# Altium schematic sheet Fleet-Monitor-Ethernet.SchDoc: Fleet Monitor
size A4; Subtitle: Ethernet Interface; DocumentNumber: 5; Revision: V1.0; SheetNumber: 6; SheetTotal: 8; Author: Florian Baumgartner & Luca Jost
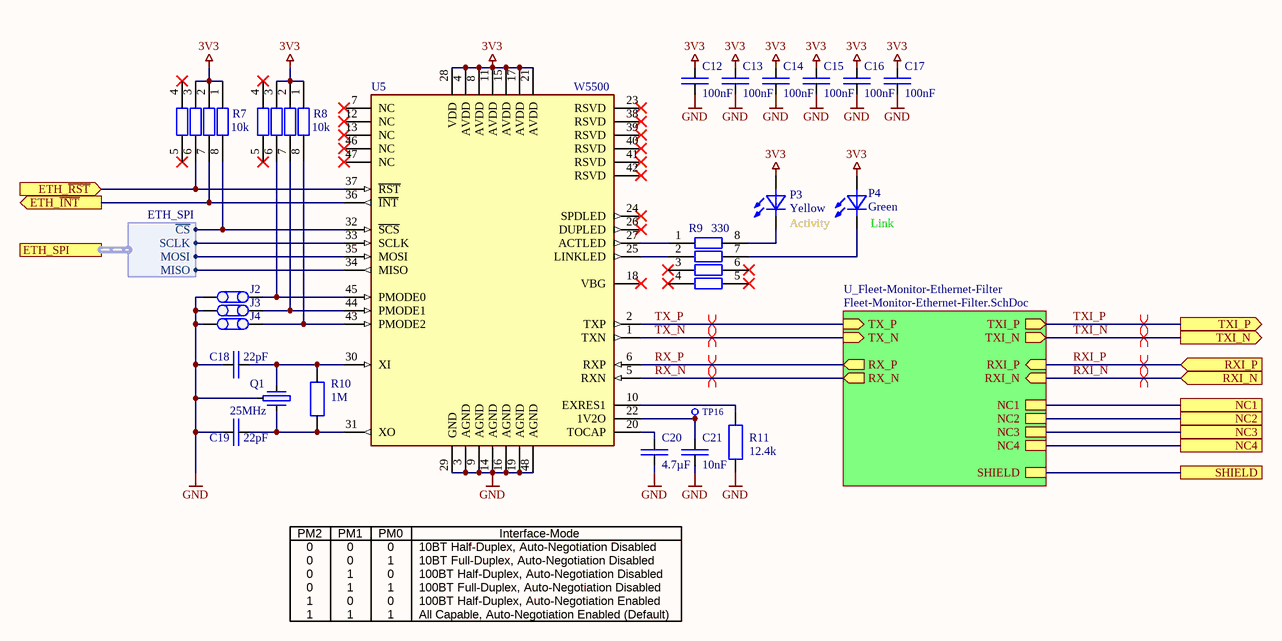
[diagram p0: Fleet-Monitor-Ethernet.SchDoc]

## Parts
C12  100nF  [SMD Keramikkondensator 0603]
C13  100nF  [SMD Keramikkondensator 0603]
C14  100nF  [SMD Keramikkondensator 0603]
C15  100nF  [SMD Keramikkondensator 0603]
C16  100nF  [SMD Keramikkondensator 0603]
C17  100nF  [SMD Keramikkondensator 0603]
C18  22pF  [SMD Keramikkondensator 0603]
C19  22pF  [SMD Keramikkondensator 0603]
C20  4.7µF  [SMD Keramikkondensator 0603]
C21  10nF  [SMD Keramikkondensator 0603]
J2  X-Jumper (2 Fach)  [SMD Solder Jumper 1x2mm]  (value not drawn)
J3  X-Jumper (2 Fach)  [SMD Solder Jumper 1x2mm]  (value not drawn)
J4  X-Jumper (2 Fach)  [SMD Solder Jumper 1x2mm]  (value not drawn)
P3  Yellow  [SMD LED 0603]
P4  Green  [SMD LED 0603]
Q1  25MHz  [SMD Crystal 2520]
R7  10k  [SMD Widerstand Array 4-Fach 0603]
R8  10k  [SMD Widerstand Array 4-Fach 0603]
R9  330  [SMD Widerstand Array 4-Fach 0603]
R10  1M  [SMD Widerstand 0603]
R11  12.4k  [SMD Widerstand 0603]
TP16  X-TP  [SMD Testpunkt Ø1mm]  (value not drawn)  (no BOM)
U5  W5500  [SMD IC LQFP-48]

## Sub-sheets
U_Fleet-Monitor-Ethernet-Filter = Fleet-Monitor-Ethernet-Filter.SchDoc: TXI_P (out), TXI_N (out), RXI_P (in), RXI_N (in), TX_P (in), TX_N (in), RX_P (out), RX_N (out), NC1, NC2, NC3, NC4, SHIELD

## Ports
ETH_SPI (harness ETH_SPI), ETH_~{INT} (out), ETH_~{RST} (in), NC1, NC2, NC3, NC4, RXI_N (in), RXI_P (in), SHIELD, TXI_N (out), TXI_P (out)

## Harnesses
ETH_SPI: ~{CS}, MOSI, MISO, SCLK

## Nets
3V3: C12.2 C13.2 C14.2 C15.2 C16.2 C17.2 P3.A P4.A R7.1 R7.2 R7.3 R8.1 R8.2 R8.3 U5.4(AVDD) U5.8(AVDD) U5.11(AVDD) U5.15(AVDD) U5.17(AVDD) U5.21(AVDD) U5.28(VDD)
GND: C12.1 C13.1 C14.1 C15.1 C16.1 C17.1 C18.2 C19.2 C20.1 C21.1 J2.1 J3.1 J4.1 Q1.3 R11.1 U5.3(AGND) U5.9(AGND) U5.14(AGND) U5.16(AGND) U5.19(AGND) U5.29(GND) U5.48(AGND)
ETH_~{INT}: R7.7 U5.36(~{INT}) ; port ETH_~{INT}
ETH_~{RST}: R7.6 U5.37(~{RST}) ; port ETH_~{RST}
NC1: port NC1, sheet U_Fleet-Monitor-Ethernet-Filter/NC1
NC2: port NC2, sheet U_Fleet-Monitor-Ethernet-Filter/NC2
NC3: port NC3, sheet U_Fleet-Monitor-Ethernet-Filter/NC3
NC4: port NC4, sheet U_Fleet-Monitor-Ethernet-Filter/NC4
RX_N: U5.5(RXN) ; sheet U_Fleet-Monitor-Ethernet-Filter/RX_N
RX_P: U5.6(RXP) ; sheet U_Fleet-Monitor-Ethernet-Filter/RX_P
RXI_N: port RXI_N, sheet U_Fleet-Monitor-Ethernet-Filter/RXI_N
RXI_P: port RXI_P, sheet U_Fleet-Monitor-Ethernet-Filter/RXI_P
SHIELD: port SHIELD, sheet U_Fleet-Monitor-Ethernet-Filter/SHIELD
TX_N: U5.1(TXN) ; sheet U_Fleet-Monitor-Ethernet-Filter/TX_N
TX_P: U5.2(TXP) ; sheet U_Fleet-Monitor-Ethernet-Filter/TX_P
TXI_N: port TXI_N, sheet U_Fleet-Monitor-Ethernet-Filter/TXI_N
TXI_P: port TXI_P, sheet U_Fleet-Monitor-Ethernet-Filter/TXI_P
NetC18_1: C18.1 Q1.1 R10.1 U5.30(XI)
NetC19_1: C19.1 Q1.2 R10.2 U5.31(XO)
NetC20_2: C20.2 U5.20(TOCAP)
NetC21_2: C21.2 TP16.1 U5.22(1V2O)
NetJ2_2: J2.2 R8.6 U5.45(PMODE0)
NetJ3_2: J3.2 R8.7 U5.44(PMODE1)
NetJ4_2: J4.2 R8.8 U5.43(PMODE2)
NetP3_K: P3.K R9.8
NetP4_K: P4.K R9.7
NetR7_8: R7.8 U5.32(~{SCS}) ; port ETH_SPI.~{CS}
NetR9_1: R9.1 U5.27(ACTLED)
NetR9_2: R9.2 U5.25(LINKLED)
NetR11_2: R11.2 U5.10(EXRES1)
NetU5_33: U5.33(SCLK) ; port ETH_SPI.SCLK
NetU5_34: U5.34(MISO) ; port ETH_SPI.MISO
NetU5_35: U5.35(MOSI) ; port ETH_SPI.MOSI

Not connected (* = marked no-connect by the designer): R7 4* 5*; R8 4* 5*; R9 3* 4* 5* 6*; U5 7(NC)* 12(NC)* 13(NC)* 18(VBG)* 23(RSVD)* 24(SPDLED)* 26(DUPLED)* 38(RSVD)* 39(RSVD)* 40(RSVD)* 41(RSVD)* 42(RSVD)* 46(NC)* 47(NC)*

## Layout directives
differential pair: RX_N, RX_P, RXI_N, RXI_P, TX_N, TX_P, TXI_N, TXI_P

## Notes on the sheet
- Activity
- (near P4) Link
- PM2
- 0
- PM1
- 1
- PM0
- 10BT Half-Duplex, Auto-Negotiation Disabled
- 10BT Full-Duplex, Auto-Negotiation Disabled
- 100BT Half-Duplex, Auto-Negotiation Disabled
- Interface-Mode
- 100BT Full-Duplex, Auto-Negotiation Disabled
- 100BT Half-Duplex, Auto-Negotiation Enabled
- All Capable, Auto-Negotiation Enabled (Default)
- Title
- Author:
- Subtitle
- Date:
- Rev:
- File:
- Sheet
- of

## Library data of the parts
C12-C17 = E6 - 100nF: SMD Ceramic Capacitor E6; Component Value: 100nF 50V; Component Description: Multilayer Ceramic Capacitors MLCC; ComponentLink1Description: Datasheet; ComponentLink1URL: https://datasheet.lcsc.com/lcsc/1809301912_YAGEO-CC0603KRX7R9BB104_C14663.pdf; Digikey: 445-6899-1-ND; Farnell: 2210822; JLC-Parts: C14663; Mouser: 810-CGA2B3X7R1H104K; Unit Price: 0.01
C18 C19 = E6 - 22pF: SMD Ceramic Capacitor E6; Component Value: 22pF 50V; Component Description: Multilayer Ceramic Capacitors MLCC; ComponentLink1Description: Datasheet; ComponentLink1URL: https://datasheet.lcsc.com/lcsc/1810121815_Samsung-Electro-Mechanics-CL10C220JB8NNNC_C1653.pdf; Digikey: 1276-1023-1-ND; Farnell: 2332643; JLC-Parts: C1653; Mouser: 187-CL10C220JB8NNNC; Unit Price: 0.01
C20 = E6 - 4.7uF: SMD Ceramic Capacitor E6; Component Value: 4.7µF 16V; Component Description: Multilayer Ceramic Capacitors MLCC; ComponentLink1Description: Datasheet; ComponentLink1URL: https://datasheet.lcsc.com/lcsc/1810261514_Samsung-Electro-Mechanics-CL10A475KO8NNNC_C19666.pdf; Digikey: 1276-1784-1-ND; Farnell: 3013397; JLC-Parts: C19666; Mouser: 187-CL10A475KO8NNNC; Unit Price: 0.01
C21 = E6 - 10nF: SMD Ceramic Capacitor E6; Component Value: 10nF 50V; Component Description: Multilayer Ceramic Capacitors MLCC; ComponentLink1Description: Datasheet; ComponentLink1URL: https://datasheet.lcsc.com/lcsc/2102081402_FH-Guangdong-Fenghua-Advanced-Tech-0603B103K500NT_C57112.pdf; Digikey: 478-3700-1-ND; Farnell: 1833876; JLC-Parts: C57112; Mouser: 581-06031C103J; Unit Price: 0.01
J2-J4 = X-Jumper (2 Fach): Component Value: 2-Pol; Component Description: Solder Jumper; Unit Price: 0.00
P3 = LED Yellow 0603: General Purpose LED; Component Value: Yellow (5mA, 2.0V); Digikey: 350-2032-1-ND; Farnell: 1465989; Mouser: 645-598-8040-107F; Unit Price: 0.34; ComponentLink1Description: Datasheet; ComponentLink1URL: https://datasheet.lcsc.com/szlcsc/Everlight-Elec-19-217-GHC-YR1S2-3T_C72043.pdf; JLC-Parts: C72038; Component Description: General Purpose LED
P4 = LED Green 0603: General Purpose LED; Component Value: Green (5mA, 2.4V); Digikey: 350-2035-1-ND; Farnell: 1465991; Mouser: 645-598-8070-107F; Unit Price: 0.34; ComponentLink1Description: Datasheet; ComponentLink1URL: https://datasheet.lcsc.com/szlcsc/Everlight-Elec-19-217-GHC-YR1S2-3T_C72043.pdf; JLC-Parts: C72043; Component Description: General Purpose LED
Q1 = Crystal 25MHz 7E25000E20UCG: SMD Crystal Resonators 25MHz 10ppm -40℃~85℃; ComponentLink1Description: Datasheet; ComponentLink1URL: https://datasheet.lcsc.com/lcsc/1810170940_SJK-SHENZHEN-CRYSTAL-TECH-7E25000E20UCG_C252264.pdf; Component Value: 25MHz; Digikey: XC3050CT-ND; Farnell: 3649710; JLC-Parts: C252264; Mouser: 520-250-10-36B-CTNT; Unit Price: 0.14; Component Description: Crystal
R7 R8 = R-Array Single Quad E24 - 10k: Isolated Resistor Array; Component Value: 10k (4x, 50V, 62.5mW, 5%); ComponentLink1Description: Datasheet; ComponentLink1URL: https://datasheet.lcsc.com/lcsc/1810191515_UNI-ROYAL-Uniroyal-Elec-4D03WGJ0103T5E_C29718.pdf; Digikey: Y4103CT-ND; Farnell: 2060167; JLC-Parts: C29718; Mouser: 667-EXB-V8V103JV; Unit Price: 0.01; Component Description: Isolated Resistor Array
R9 = R-Array Single Quad E24 - 330: Isolated Resistor Array; Component Value: 330 (4x, 50V, 62.5mW, 5%); ComponentLink1Description: Datasheet; ComponentLink1URL: https://datasheet.lcsc.com/lcsc/1810170717_UNI-ROYAL-Uniroyal-Elec-4D03WGJ0331T5E_C12018.pdf; Digikey: Y4331CT-ND; Farnell: 2060160; JLC-Parts: C12018; Mouser: 667-EXB-V8V331JV; Unit Price: 0.01; Component Description: Isolated Resistor Array
R10 = E96 - 1M: SMD Chip Resistor E24; Component Value: 1M (75V, 100mW, 1%); ComponentLink1Description: Datasheet; ComponentLink1URL: https://datasheet.lcsc.com/lcsc/1810200710_UNI-ROYAL-Uniroyal-Elec-0603WAF4701T5E_C23162.pdf; Digikey: P1.00MHCT-ND; Farnell: 2303325; JLC-Parts: C22935; Mouser: 667-ERJ-3EKF1004V; Unit Price: 0.01; Component Description: Chip Resistor
R11 = E96 - 12.4k: SMD Chip Resistor E96; Component Value: 12.4k (75V, 100mW, 1%); ComponentLink1Description: Datasheet; ComponentLink1URL: https://datasheet.lcsc.com/lcsc/1810170234_PANASONIC-ERJ3EKF1242V_C194071.pdf; Digikey: P12.4KHCT-ND; Farnell: 2059414; JLC-Parts: C194071; Mouser: 667-ERJ-3EKF1242V; Unit Price: 0.01; Component Description: Chip Resistor
TP16 = X-TP: Testpunkt; Component Value: Ø 0.8mm; Component Description: Testpoint; Unit Price: 0.00
U5 = W5500: Ethernet Controller 10/100 Base-T/TX PHY SPI Interface 48-LQFP (7x7); ComponentLink1Description: Datasheet; ComponentLink1URL: http://wizwiki.net/wiki/lib/exe/fetch.php?media=products:w5500:w5500_ds_v108e.pdf; Digikey: 1278-W5500TR-ND; Component Value: W5500; JLC-Parts: C32843; Mouser: 950-W5500; Unit Price: 3.76; Component Description: Ethernet Controller